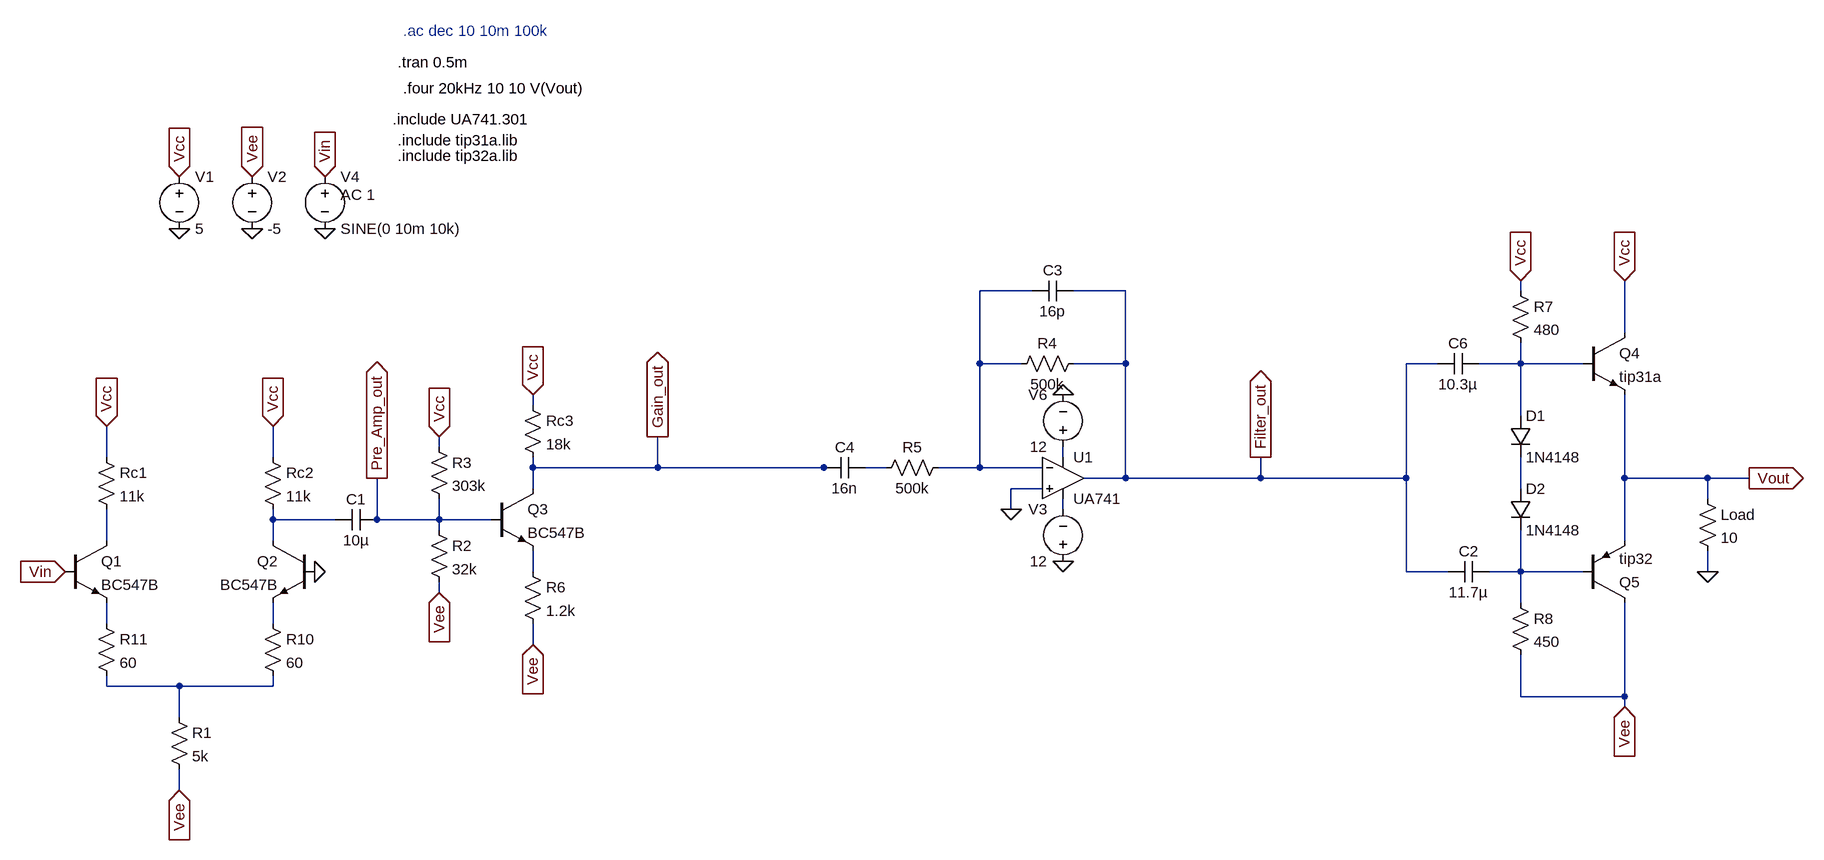
[diagram p0: schematic audio_amplifier.asc]
audio_amplifier.asc, the LTspice schematic file:
Version 4
SHEET 1 4080 872
WIRE 1968 -80 1888 -80
WIRE 2112 -80 2032 -80
WIRE 2720 -80 2720 -96
WIRE 2880 -16 2880 -96
WIRE 1888 32 1888 -80
WIRE 1952 32 1888 32
WIRE 2112 32 2112 -80
WIRE 2112 32 2032 32
WIRE 2592 32 2544 32
WIRE 2720 32 2720 0
WIRE 2720 32 2656 32
WIRE 2816 32 2720 32
WIRE 1200 96 1200 80
WIRE 2720 112 2720 32
WIRE 1056 160 1056 144
WIRE 544 176 544 128
WIRE 800 176 800 128
WIRE 2016 176 2016 160
WIRE 1200 192 1200 176
WIRE 1392 192 1392 144
WIRE 1392 192 1200 192
WIRE 1648 192 1392 192
WIRE 1664 192 1648 192
WIRE 1744 192 1712 192
WIRE 1888 192 1888 32
WIRE 1888 192 1824 192
WIRE 1984 192 1888 192
WIRE 2112 208 2112 32
WIRE 2112 208 2048 208
WIRE 2320 208 2320 176
WIRE 2320 208 2112 208
WIRE 2544 208 2544 32
WIRE 2544 208 2320 208
WIRE 2880 208 2880 80
WIRE 3008 208 2880 208
WIRE 3072 208 3008 208
WIRE 1200 224 1200 192
WIRE 1984 224 1936 224
WIRE 2720 224 2720 176
WIRE 3008 240 3008 208
WIRE 1936 256 1936 224
WIRE 2016 256 2016 240
WIRE 800 272 800 256
WIRE 896 272 800 272
WIRE 960 272 960 208
WIRE 1056 272 1056 240
WIRE 1056 272 960 272
WIRE 1136 272 1056 272
WIRE 1056 288 1056 272
WIRE 544 304 544 256
WIRE 800 304 800 272
WIRE 2880 304 2880 208
WIRE 1200 352 1200 320
WIRE 2544 352 2544 208
WIRE 2608 352 2544 352
WIRE 2720 352 2720 288
WIRE 2720 352 2672 352
WIRE 2816 352 2720 352
WIRE 3008 352 3008 320
WIRE 1056 384 1056 368
WIRE 2720 400 2720 352
WIRE 544 432 544 400
WIRE 800 432 800 400
WIRE 1200 464 1200 432
WIRE 544 528 544 512
WIRE 656 528 544 528
WIRE 800 528 800 512
WIRE 800 528 656 528
WIRE 2720 544 2720 480
WIRE 2880 544 2880 400
WIRE 2880 544 2720 544
WIRE 2880 560 2880 544
WIRE 656 576 656 528
WIRE 656 688 656 656
FLAG 656 -176 0
FLAG 768 -176 0
FLAG 656 -256 Vcc
IOPIN 656 -256 In
FLAG 768 -256 Vee
IOPIN 768 -256 In
FLAG 656 688 Vee
IOPIN 656 688 In
FLAG 800 128 Vcc
IOPIN 800 128 In
FLAG 1936 256 0
FLAG 1056 144 Vcc
IOPIN 1056 144 In
FLAG 1200 80 Vcc
IOPIN 1200 80 In
FLAG 544 128 Vcc
IOPIN 544 128 In
FLAG 880 -176 0
FLAG 880 -256 Vin
IOPIN 880 -256 In
FLAG 480 352 Vin
IOPIN 480 352 In
FLAG 1056 384 Vee
IOPIN 1056 384 In
FLAG 1200 464 Vee
IOPIN 1200 464 In
FLAG 3072 208 Vout
IOPIN 3072 208 Out
FLAG 2880 -96 Vcc
IOPIN 2880 -96 In
FLAG 2720 -96 Vcc
IOPIN 2720 -96 In
FLAG 3008 352 0
FLAG 2880 560 Vee
IOPIN 2880 560 In
FLAG 2016 336 0
FLAG 2016 80 0
FLAG 864 352 0
FLAG 960 208 Pre_Amp_out
IOPIN 960 208 Out
FLAG 1392 144 Gain_out
IOPIN 1392 144 Out
FLAG 2320 176 Filter_out
IOPIN 2320 176 Out
SYMBOL npn 480 304 R0
SYMATTR InstName Q1
SYMATTR Value BC547B
SYMBOL npn 864 304 M0
SYMATTR InstName Q2
SYMATTR Value BC547B
SYMBOL voltage 656 -272 R0
WINDOW 123 0 0 Left 0
WINDOW 39 0 0 Left 0
SYMATTR InstName V1
SYMATTR Value 5
SYMBOL voltage 768 -272 R0
WINDOW 123 0 0 Left 0
WINDOW 39 0 0 Left 0
SYMATTR InstName V2
SYMATTR Value -5
SYMBOL res 640 560 R0
SYMATTR InstName R1
SYMATTR Value 5k
SYMBOL res 784 160 R0
SYMATTR InstName Rc2
SYMATTR Value 11k
SYMBOL cap 960 256 R90
WINDOW 0 0 32 VBottom 2
WINDOW 3 32 32 VTop 2
SYMATTR InstName C1
SYMATTR Value 10µ
SYMBOL res 1040 272 R0
SYMATTR InstName R2
SYMATTR Value 32k
SYMBOL res 1040 144 R0
SYMATTR InstName R3
SYMATTR Value 303k
SYMBOL res 1184 80 R0
SYMATTR InstName Rc3
SYMATTR Value 18k
SYMBOL npn 1136 224 R0
SYMATTR InstName Q3
SYMATTR Value BC547B
SYMBOL OpAmps\\opamp2 2016 144 R0
SYMATTR InstName U1
SYMATTR Value UA741
SYMBOL cap 2032 -96 R90
WINDOW 0 0 32 VBottom 2
WINDOW 3 32 32 VTop 2
SYMATTR InstName C3
SYMATTR Value 16p
SYMBOL res 2048 16 R90
WINDOW 0 0 56 VBottom 2
WINDOW 3 32 56 VTop 2
SYMATTR InstName R4
SYMATTR Value 500k
SYMBOL res 1840 176 R90
WINDOW 0 0 56 VBottom 2
WINDOW 3 32 56 VTop 2
SYMATTR InstName R5
SYMATTR Value 500k
SYMBOL cap 1712 176 R90
WINDOW 0 0 32 VBottom 2
WINDOW 3 32 32 VTop 2
SYMATTR InstName C4
SYMATTR Value 16n
SYMBOL voltage 880 -272 R0
WINDOW 123 24 44 Left 2
WINDOW 39 0 0 Left 0
SYMATTR Value2 AC 1
SYMATTR InstName V4
SYMATTR Value SINE(0 10m 10k)
SYMBOL res 528 160 R0
SYMATTR InstName Rc1
SYMATTR Value 11k
SYMBOL diode 2704 112 R0
SYMATTR InstName D1
SYMATTR Value 1N4148
SYMBOL diode 2704 224 R0
SYMATTR InstName D2
SYMATTR Value 1N4148
SYMBOL res 2704 -96 R0
SYMATTR InstName R7
SYMATTR Value 480
SYMBOL res 2704 384 R0
SYMATTR InstName R8
SYMATTR Value 450
SYMBOL res 2992 224 R0
SYMATTR InstName Load
SYMATTR Value 10
SYMBOL voltage 2016 352 R180
WINDOW 0 24 96 Left 2
WINDOW 3 24 16 Left 2
WINDOW 123 0 0 Left 0
WINDOW 39 0 0 Left 0
SYMATTR InstName V3
SYMATTR Value 12
SYMBOL voltage 2016 176 R180
WINDOW 0 24 96 Left 2
WINDOW 3 24 16 Left 2
WINDOW 123 0 0 Left 0
WINDOW 39 0 0 Left 0
SYMATTR InstName V6
SYMATTR Value 12
SYMBOL cap 2672 336 R90
WINDOW 0 0 32 VBottom 2
WINDOW 3 32 32 VTop 2
SYMATTR InstName C2
SYMATTR Value 11.7µ
SYMBOL cap 2656 16 R90
WINDOW 0 0 32 VBottom 2
WINDOW 3 32 32 VTop 2
SYMATTR InstName C6
SYMATTR Value 10.3µ
SYMBOL npn 2816 -16 R0
SYMATTR InstName Q4
SYMATTR Value tip31a
SYMBOL pnp 2816 400 M180
SYMATTR InstName Q5
SYMATTR Value tip32
SYMBOL res 1184 336 R0
SYMATTR InstName R6
SYMATTR Value 1.2k
SYMBOL res 784 416 R0
SYMATTR InstName R10
SYMATTR Value 60
SYMBOL res 528 416 R0
SYMATTR InstName R11
SYMATTR Value 60
TEXT 984 -344 Left 2 !.include UA741.301
TEXT 1000 -392 Left 2 !.four 20kHz 10 10 V(Vout)
TEXT 992 -432 Left 2 !.tran 0.5m
TEXT 992 -312 Left 2 !.include tip31a.lib
TEXT 992 -288 Left 2 !.include tip32a.lib
TEXT 1000 -480 Left 2 ;.ac dec 10 10m 100k

The netlist it stands for:
* audio_amplifier.asc
Q1 N008 Vin N011 0 BC547B
Q2 N007 0 N012 0 BC547B
V1 Vcc 0 5
V2 Vee 0 -5
R1 N013 Vee 5k
Rc2 Vcc N007 11k
C1 Pre_Amp_out N007 10µ
R2 Pre_Amp_out Vee 32k
R3 Vcc Pre_Amp_out 303k
Rc3 Vcc Gain_out 18k
Q3 Gain_out Pre_Amp_out N009 0 BC547B
XU1 0 N001 N003 N006 Filter_out UA741  ; pins In+ In- V+ V- OUT
C3 Filter_out N001 16p
R4 Filter_out N001 500k
R5 N001 N004 500k
C4 N004 Gain_out 16n
V4 Vin 0 SINE(0 10m 10k) AC 1
Rc1 Vcc N008 11k
D1 N002 N005 1N4148
D2 N005 N010 1N4148
R7 Vcc N002 480
R8 N010 Vee 450
R§Load Vout 0 10
V3 0 N006 12
V6 N003 0 12
C2 N010 Filter_out 11.7µ
C6 N002 Filter_out 10.3µ
Q4 Vcc N002 Vout 0 tip31a
Q5 Vee N010 Vout 0 tip32
R6 N009 Vee 1.2k
R10 N012 N013 60
R11 N011 N013 60
.model D D
.lib standard.dio
.model NPN NPN
.model PNP PNP
.lib standard.bjt
.include UA741.301
.four 20kHz 10 10 V(Vout)
.tran 0.5m
.include tip31a.lib
.include tip32a.lib
* .ac dec 10 10m 100k
.backanno
.end